# Altium project PCB.PrjPcb (part 2 of 2)
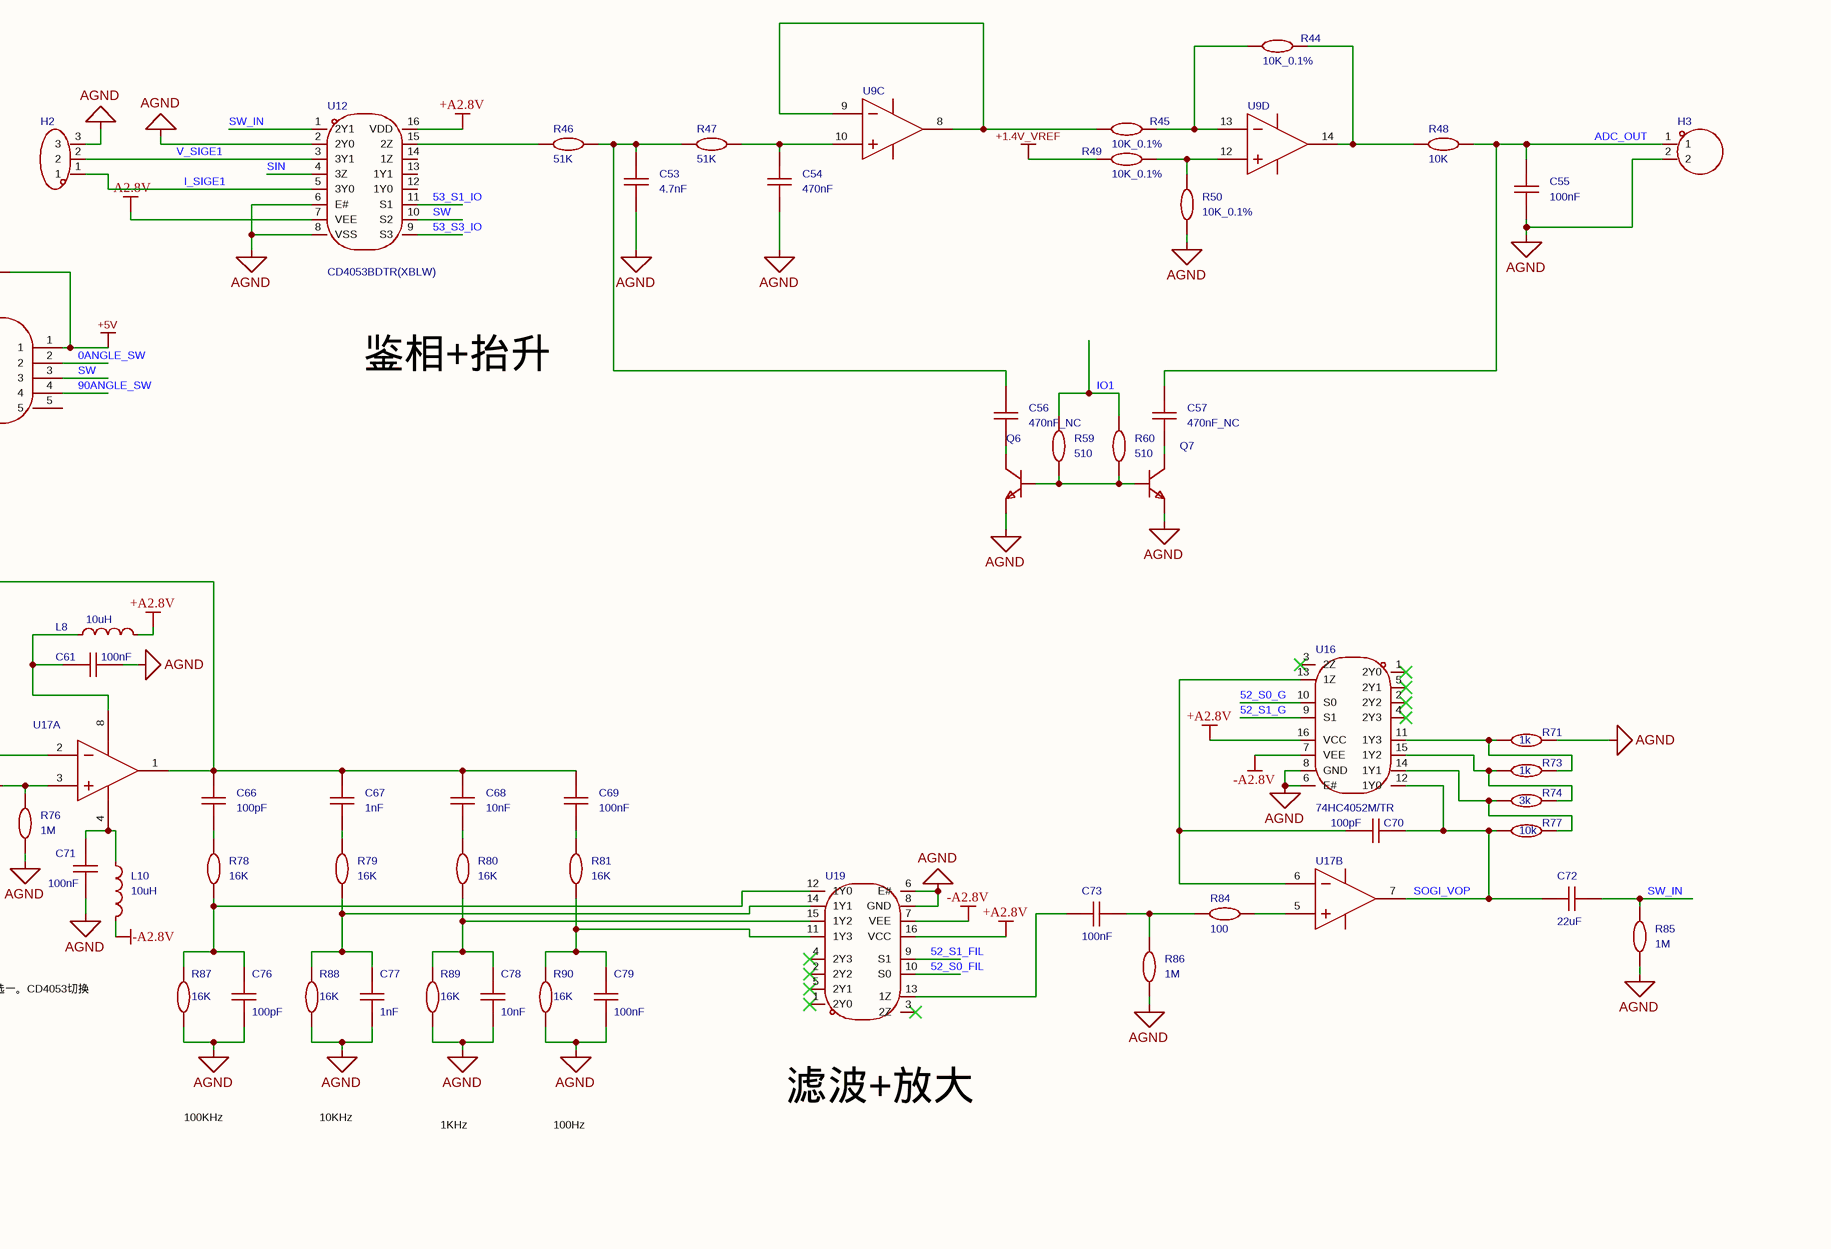
[diagram p8: Sheet1.SchDoc, row 4 of 4 right]

## Sheet Sheet1.SchDoc
size 800 x 1399 mm

### Parts
BAT1  XH2.54直插座-2P  [CONN-TH_XH2.54-2P]  (value not drawn)
BUZZER1  value 2.4kHz  [BUZ-TH_BD12.0-P7.60-D0.6-FD]  (hidden comment: TMB12A05_C96093)
C1  10uF  [C0805]
C2  100nF  [C0603]
C3  10uF  [C0805]
C4  value 22pF_NC  [C0603]  (hidden comment: CAP_0603)
C5  value 10nF  [C0603]  (hidden comment: CAP_0603)
C6  value 22pF  [C0603]  (hidden comment: CAP_0603)
C7  value 100nF  [C0603]  (hidden comment: CAP_0603)
C8  value 100nF  [C0603]  (hidden comment: CAP_0603)
C9  value 22uF  [C0805]  (hidden comment: CAP_0805)
C10  value 100nF  [C0603]  (hidden comment: CAP_0603)
C11  value 100nF  [C0603]  (hidden comment: CAP_0603)
C12  value 100nF  [C0603]  (hidden comment: CAP_0603)
C13  value 22pF  [C0603]  (hidden comment: CAP_0603)
C14  value 100nF  [C0603]  (hidden comment: CAP_0603)
C15  value 22pF  [C0603]  (hidden comment: CAP_0603)
C16  value 100nF  [C0603]  (hidden comment: CAP_0603)
C17  value 100nF  [C0603]  (hidden comment: CAP_0603)
C18  value 1uF  [C0603]  (hidden comment: CAP_0603)
C19  value 10nF  [C0603]  (hidden comment: CAP_0603)
C20  value 22uF  [C0805]  (hidden comment: CAP_0805)
C21  value 100nF  [C0603]  (hidden comment: CAP_0805)
C22  value 100nF  [C0603]  (hidden comment: CAP_0805)
C23  value 100nF  [C0603]  (hidden comment: CAP_0805)
C24  value 220uF  [CAP-TH_BD8.0-P3.50-D0.6-FD-2]  (hidden comment: KNH2220UF35V149EC0049)
C25  value 100nF  [C0603]  (hidden comment: CAP_0603)
C26  value 22uF  [C0805]  (hidden comment: CAP_0805)
C27  104  [C0603]
C28  104  [C0603]
C29  104  [C0603]
C30  104  [C0603]
C31  104  [C0603]
C32  104  [C0603]
C33  104  [C0603]
C34  104  [C0603]
C35  104  [C0603]
C36  104  [C0603]
C37  104  [C0603]
C38  104  [C0603]
C39  104  [C0603]
C40  value 100nF  [C0603]  (hidden comment: CAP_0603)
C41  value 100nF  [C0603]  (hidden comment: CAP_0603)
C42  value 22uF  [C0805]  (hidden comment: CAP_0805)
C43  value 22uF  [C0805]  (hidden comment: CAP_0805)
C44  value 100nF  [C0603]  (hidden comment: CAP_0603)
C45  value 22uF  [C0805]  (hidden comment: CAP_0805)
C46  value 100nF  [C0603]  (hidden comment: CAP_0603)
C47  value 100nF  [C0603]  (hidden comment: CAP_0603)
C48  value 100nF  [C0603]  (hidden comment: CAP_0603)
C49  value 100nF  [C0603]  (hidden comment: CAP_0402)
C50  value 100pF_NC  [C0603]  (hidden comment: CAP_0402)
C51  value 1uF  [C0603]  (hidden comment: CAP_0402)
C52  value 100nF  [C0603]  (hidden comment: CAP_0402)
C53  value 4.7nF  [C0603]  (hidden comment: CAP_0603)
C54  value 470nF  [C0603]  (hidden comment: CAP_0603)
C55  value 100nF  [C0603]  (hidden comment: CAP_0603)
C56  value 470nF_NC  [C0603]  (hidden comment: CAP_0603)
C57  value 470nF_NC  [C0603]  (hidden comment: CAP_0603)
C58  value 100pF_NC  [C0603]  (hidden comment: CAP_0402)
C59  value 220nF  [C0603]  (hidden comment: CAP_0402)
C60  value 220nF  [C0603]  (hidden comment: CAP_0402)
C61  value 100nF  [C0603]  (hidden comment: CAP_0603)
C62  value 220nF  [C0603]  (hidden comment: CAP_0402)
C63  value 100nF  [C0603]  (hidden comment: CAP_0402)
C64  value 100pF_NC  [C0603]  (hidden comment: CAP_0402)
C65  value 100nF  [C0603]  (hidden comment: CAP_0603)
C66  value 100pF  [C0603]  (hidden comment: CAP_0603)
C67  value 1nF  [C0603]  (hidden comment: CAP_0603)
C68  value 10nF  [C0603]  (hidden comment: CAP_0603)
C69  value 100nF  [C0603]  (hidden comment: CAP_0603)
C70  value 100pF  [C0603]  (hidden comment: CAP_0603)
C71  value 100nF  [C0603]  (hidden comment: CAP_0603)
C72  value 22uF  [C0805]  (hidden comment: CAP_0603)
C73  value 100nF  [C0603]  (hidden comment: CAP_0603)
C74  value 100nF  [C0603]  (hidden comment: CAP_0402)
C75  value 100pF  [C0603]  (hidden comment: CAP_0402)
C76  value 100pF  [C0603]  (hidden comment: CAP_0603)
C77  value 1nF  [C0603]  (hidden comment: CAP_0603)
C78  value 10nF  [C0603]  (hidden comment: CAP_0603)
C79  value 100nF  [C0603]  (hidden comment: CAP_0603)
C80  value 100pF_NC  [C0603]  (hidden comment: CAP_0402)
C81  value 220nF  [C0603]  (hidden comment: CAP_0402)
C82  value 220nF  [C0603]  (hidden comment: CAP_0402)
C83  value 220nF  [C0603]  (hidden comment: CAP_0402)
C84  value 100pF_NC  [C0603]  (hidden comment: CAP_0402)
CE1  3.3uF/16V  [C0805]
CE2  22uF/16V  [C0805]
CE3  22uF/16V  [C0805]
CE4  22uF/16V  [C0805]
CE5  22uF/16V  [C0805]
D1  Manufacturer Part: SS24  [SMA_L4.3-W2.6-LS5.0-FD]  (hidden comment: SS24_C7420362)
D2  Manufacturer Part: SS24  [SMA_L4.3-W2.6-LS5.0-FD]  (hidden comment: SS24_C7420362)
D3  FR107_C963379  [SOD-123_L2.8-W1.8-LS3.7-RD]  (value not drawn)
D4  BAT54S,215  [SOT-23-3_L3.0-W1.7-P0.95-LS2.9-BR]  (value not drawn)
D5  BAT54S,215  [SOT-23-3_L3.0-W1.7-P0.95-LS2.9-BR]  (value not drawn)
H1  (no value)  [HDR-TH_4P-P2.54-V-F]
H2  (no value)  [HDR-TH_3P-P2.54-V-M]
H3  HDR-M_2.54_1x2P  [HDR-TH_2P-P2.54-V-M-1]  (value not drawn)
H4  (no value)  [HDR-TH_5P-P2.54-V-M]
L1  value 10uH  [L0603]  (hidden comment: L_0603)
L2  BLM15AG102SN1D  [L0603]  (value not drawn)
L3  value 10uH  [IND-SMD_L7.3-W6.8]  (hidden comment: FXL0630-100-M)
L4  value 10uH  [L0603]  (hidden comment: L_0603)
L5  value 10uH  [L0603]  (hidden comment: L_0603)
L6  BLM15AG102SN1D  [L0603]  (value not drawn)
L7  BLM15AG102SN1D  [L0603]  (value not drawn)
L8  value 10uH  [L0603]  (hidden comment: L_0603)
L9  BLM15AG102SN1D  [L0603]  (value not drawn)
L10  value 10uH  [L0603]  (hidden comment: L_0603)
L11  BLM15AG102SN1D  [L0603]  (value not drawn)
LED1  LED_0603-R  [LED_0603]  (value not drawn)
LED2  LED_0603-R  [LED_0603]  (value not drawn)
LED3  LED_0603-R  [LED_0603]  (value not drawn)
LED4  LED_0603-R  [LED_0603]  (value not drawn)
LED5  LED_0603-R  [LED_0603]  (value not drawn)
LED6  LED_0603-R  [LED_0603]  (value not drawn)
P1  XH2.54直插座-2P  [CONN-TH_XH2.54-2P]  (value not drawn)
Q1  AO3401A_P  [AO3401A_SOT-23-3]
Q2  S8050_SOT_NPN  [S8050_SOT-23]  (value not drawn)
Q3  AO3401A_P  [AO3401A_SOT-23-3]
Q4  (no value)  [SOT-23-3_L2.9-W1.3-P1.90-LS2.4-BR]
Q5  AO3400A_C20917  [SOT-23-3_L2.9-W1.3-P1.90-LS2.4-BR]  (value not drawn)
Q6  S8050_SOT_NPN  [S8050_SOT-23]  (value not drawn)
Q7  S8050_SOT_NPN  [S8050_SOT-23]  (value not drawn)
R1  value 10K  [R0603]  (hidden comment: Res_0603)
R2  value 10K  [R0603]  (hidden comment: Res_0603)
R3  value 10K  [R0603]  (hidden comment: Res_0603)
R4  value 10K  [R0603]  (hidden comment: Res_0603)
R5  value 10K_NC  [R0603]  (hidden comment: Res_0603)
R6  value 10K_NC  [R0603]  (hidden comment: Res_0603)
R7  value 10K_NC  [R0603]  (hidden comment: Res_0603)
R8  value 10K  [R0603]  (hidden comment: Res_0603)
R9  value 1k  [R0603]  (hidden comment: Res_0603)
R10  value 1k  [R0603]  (hidden comment: Res_0603)
R11  value 10K  [R0603]  (hidden comment: Res_0603)
R12  value 10K  [R0603]  (hidden comment: Res_0603)
R13  value 510  [R0603]  (hidden comment: Res_0603)
R14  value 100  [R0603]  (hidden comment: Res_0805)
R15  value 100  [R0603]  (hidden comment: Res_0805)
R16  value 2k  [R0603]  (hidden comment: Res_0603)
R17  value 510  [R0603]  (hidden comment: Res_0603)
R18  value 10K  [R0603]  (hidden comment: Res_0805)
R19  value 2k  [R0603]  (hidden comment: Res_0603)
R20  value 10K  [R0603]  (hidden comment: Res_0603)
R21  value 10K  [R0603]  (hidden comment: Res_0603)
R22  value 2k  [R0603]  (hidden comment: Res_0603)
R23  value 10K  [R0603]  (hidden comment: Res_0805)
R24  value 2k  [R0603]  (hidden comment: Res_0603)
R25  value 5.1K  [R0603]  (hidden comment: Res_0603)
R26  value 5.1K  [R0603]  (hidden comment: Res_0603)
R27  value 1k  [R0603]  (hidden comment: Res_0603)
R28  value 10K  [R0603]  (hidden comment: Res_0603)
R29  value 10K  [R0603]  (hidden comment: Res_0603)
R30  value 11k  [R0603]  (hidden comment: Res_0603)
R31  value 10K  [R0603]  (hidden comment: Res_0603)
R32  value 10K  [R0603]  (hidden comment: Res_0603)
R33  value 10k  [R0603]  (hidden comment: Res_0603)
R34  value 1.5k  [R0603]  (hidden comment: Res_0603)
R35  value 10k_0.1%  [R0603]  (hidden comment: Res_0603)
R36  value 000  [R0603]  (hidden comment: Res_0603)
R37  value 000  [R0603]  (hidden comment: Res_0603)
R38  value 000  [R0603]  (hidden comment: Res_0603)
R39  value 10k  [R0603]  (hidden comment: Res_0603)
R40  value 10k_0.1%  [R0603]  (hidden comment: Res_0603)
R41  value 1M  [R0603]  (hidden comment: Res_0603)
R42  value 100  [R0603]  (hidden comment: Res_0603)
R43  value 5.1K  [R0603]  (hidden comment: Res_0603)
R44  value 10K_0.1%  [R0603]  (hidden comment: Res_0603)
R45  value 10K_0.1%  [R0603]  (hidden comment: Res_0603)
R46  value 51K  [R0603]  (hidden comment: Res_0603)
R47  value 51K  [R0603]  (hidden comment: Res_0603)
R48  value 10K  [R0603]  (hidden comment: Res_0603)
R49  value 10K_0.1%  [R0603]  (hidden comment: Res_0603)
R50  value 10K_0.1%  [R0603]  (hidden comment: Res_0603)
R51  value 1k  [R0603]  (hidden comment: Res_0603)
R52  value 100k  [R0603]  (hidden comment: Res_0603)
R53  value 10k  [R0603]  (hidden comment: Res_0603)
R54  value 1k  [R0603]  (hidden comment: Res_0603)
R55  value 20  [R0603]  (hidden comment: Res_0603)
R56  value 10K  [R0603]  (hidden comment: Res_0603)
R57  value 10K  [R0603]  (hidden comment: Res_0603)
R58  value 20  [R0603]  (hidden comment: Res_0603)
R59  value 510  [R0603]  (hidden comment: Res_0603)
R60  value 510  [R0603]  (hidden comment: Res_0603)
R61  value 1M  [R0603]  (hidden comment: Res_0603)
R62  value 1k  [R0603]  (hidden comment: Res_0603)
R63  value 3k  [R0603]  (hidden comment: Res_0603)
R64  value 100  [R0603]  (hidden comment: Res_0603)
R65  value 1k_0.1%  [R0603]  (hidden comment: Res_0603)
R66  value 1M  [R0603]  (hidden comment: Res_0603)
R67  value 100  [R0603]  (hidden comment: Res_0603)
R68  value 1k_0.1%  [R0603]  (hidden comment: Res_0603)
R69  value 100  [R0603]  (hidden comment: Res_0603)
R70  value 3k  [R0603]  (hidden comment: Res_0603)
R71  value 1k  [R0603]  (hidden comment: Res_0603)
R72  value 1k  [R0603]  (hidden comment: Res_0603)
R73  value 1k  [R0603]  (hidden comment: Res_0603)
R74  value 3k  [R0603]  (hidden comment: Res_0603)
R75  value 000  [R0603]  (hidden comment: Res_0603)
R76  value 1M  [R0603]  (hidden comment: Res_0603)
R77  value 10k  [R0603]  (hidden comment: Res_0603)
R78  value 16K  [R0603]  (hidden comment: Res_0603)
R79  value 16K  [R0603]  (hidden comment: Res_0603)
R80  value 16K  [R0603]  (hidden comment: Res_0603)
R81  value 16K  [R0603]  (hidden comment: Res_0603)
R82  value 100  [R0603]  (hidden comment: Res_0603)
R83  value 1M  [R0603]  (hidden comment: Res_0603)
R84  value 100  [R0603]  (hidden comment: Res_0603)
R85  value 1M  [R0603]  (hidden comment: Res_0603)
R86  value 1M  [R0603]  (hidden comment: Res_0603)
R87  value 16K  [R0603]  (hidden comment: Res_0603)
R88  value 16K  [R0603]  (hidden comment: Res_0603)
R89  value 16K  [R0603]  (hidden comment: Res_0603)
R90  value 16K  [R0603]  (hidden comment: Res_0603)
R91  value 3k  [R0603]  (hidden comment: Res_0603)
R92  value 20_0.1%  [R0603]  (hidden comment: Res_0603)
R93  value 100  [R0603]  (hidden comment: Res_0603)
R94  value 1k_0.1%  [R0603]  (hidden comment: Res_0603)
R95  value 10k_0.1%  [R0603]  (hidden comment: Res_0603)
R96  value 1k_0.1%  [R0603]  (hidden comment: Res_0603)
R97  value 1M  [R0603]  (hidden comment: Res_0603)
R98  value 100k_0.1%  [R0603]  (hidden comment: Res_0603)
R99  value 100  [R0603]  (hidden comment: Res_0603)
R100  value 1k_0.1%  [R0603]  (hidden comment: Res_0603)
R101  value 3k  [R0603]  (hidden comment: Res_0603)
R102  value 100  [R0603]  (hidden comment: Res_0603)
SCREW1  (no value)  [M3螺丝]
SCREW2  (no value)  [M3螺丝]
SCREW3  (no value)  [M3螺丝]
SCREW4  (no value)  [M3螺丝]
SW1  (no value)  [Key_SMD_3.6x6.1x2.5]
SW2  (no value)  [SW-TH_4P-L6.0-W6.0-P4.50-LS6.5]
SW3  (no value)  [SW-TH_4P-L6.0-W6.0-P4.50-LS6.5]
SW4  (no value)  [SW-TH_4P-L6.0-W6.0-P4.50-LS6.5]
SW5  (no value)  [SW-TH_4P-L6.0-W6.0-P4.50-LS6.5]
SW6  XKB7070-Z  [SW-TH_6P-L7.0-W7.0-P2.00]  (value not drawn)
U1  RS8752XM  [MSOP-8_L3.0-W3.0-P0.65-LS5.0-BL]  (value not drawn)  (parts A,B of 2)
U2  74HC4052M/TR  [SOP-16_L9.9-W3.9-P1.27-LS6.0-BL]  (value not drawn)
U3  AD9833BRMZ-REEL7_C9652  [MSOP-10_L3.0-W3.0-P0.50-LS5.0-BL]  (value not drawn)
U4  STC32G12K128-35I-LQFP48  [LQFP-48_L7.0-W7.0-P0.50-LS9.0-BL]
U5  CH340N  [SOP-8_L4.9-W3.9-P1.27-LS6.0-BL]
U6  TP4056-42-ESOP8  [ESOP-8_L4.9-W3.9-P1.27-LS6.0-BL-EP]  (value not drawn)
U7  RT9193-28G  [SOT-23-5_L3.0-W1.7-P0.95-LS2.8-BR]
U8  SGM3204  [SOT-23-6_L2.9-W1.6-P0.95-LS2.8-BL]
U9  RS8554XQ  [TSSOP-14_L5.0-W4.4-P0.65-LS6.4-BL]  (value not drawn)  (parts A,B,C,D of 4)
U10  SX1308  [SOT-23-6_L2.9-W1.6-P0.95-LS2.8-BL]
U11  RS8554XP  [TSSOP-14_L5.0-W4.4-P0.65-LS6.4-BL]  (value not drawn)  (parts A,B,C,D of 4)
U12  CD4053BDTR(XBLW)  [SOP-16_L9.9-W3.9-P1.27-LS6.0-BL]
U13  GAQY211G2S  [SOP-4_L4.4-W4.0-P2.54-LS7.0-TL]
U14  74HC4052M/TR  [SOP-16_L9.9-W3.9-P1.27-LS6.0-BL]  (value not drawn)
U15  hfd31/5  [RELAY-SMD_HFD31-XX-L2SR]
U16  74HC4052M/TR  [SOP-16_L9.9-W3.9-P1.27-LS6.0-BL]
U17  RS8752XM  [MSOP-8_L3.0-W3.0-P0.65-LS5.0-BL]  (value not drawn)  (parts A,B of 2)
U18  RS8554XP  [TSSOP-14_L5.0-W4.4-P0.65-LS6.4-BL]  (value not drawn)  (parts A,B,C,D of 4)
U19  74HC4052M/TR  [SOP-16_L9.9-W3.9-P1.27-LS6.0-BL]  (value not drawn)
U20  74HC4052M/TR  [SOP-16_L9.9-W3.9-P1.27-LS6.0-BL]
USBC1  TYPE-C-31-M-12  [USB-C_SMD-TYPE-C-31-M-12]  (value not drawn)
X1  value 25MHz  [OSC-SMD_4P-L3.2-W2.5-BL]  (hidden comment: OT322525MJBA4SL)
X2  value 24MHz  [CRYSTAL-SMD_L11.5-W4.8-LS12.7]  (hidden comment: X49SM8MSD2SC)

### Blocks framed on the sheet
主控-信号采集及处理电路: BUZZER1 C13-C23 H1 L2 LED1-LED4 Q1-Q3 R12-R23 SW1-SW5 U4 U5 X2
供电电路: BAT1 C24-C26 C40 C42-C46 D1 D2 L3 LED5 LED6 Q4 R24-R28 R30 R32-R34 R37-R39 SCREW1-SCREW4 SW6 U6 U10 USBC1
DDS信号发生器电路: C1-C12 L1 R1-R11 U1-U3 X1
信号采样电路: C27-C39 C41 C47-C84 CE1-CE5 D3-D5 H2-H4 L4-L11 P1 Q5-Q7 R29 R31 R35 R36 R40-R102 U7-U9 U11-U20

### Nets
+1.4V_VREF: R36.2 R49.2
+2.8V_VREF: C17.1 C18.1 C19.1 L2.2 U4.16(Vref)
+5V: C22.2 D3.1(C) Q1.2(S) Q3.2(S) R18.2 SW6.1 U5.5(VCC) U15.1
+5V_MCU: BUZZER1.1(+) C8.2 C12.2 C35.2 CE5.1 H1.2 L1.1 P1.2 Q1.3(D) R11.2 R12.1 R20.1 R21.1 R22.1 U4.15(VCC/AVCC) U7.1(VIN) U7.3(EN) X1.4(VDD)  [also labelled VIN]
+A2.8V: C20.1 C27.2 C28.2 C29.2 C30.2 C36.2 C39.2 CE2.1 CE3.1 D4.2(K) D5.2(K) L2.1 L4.2 L7.2 L8.2 L11.1 R29.1 U7.5(VOUT) U8.2(IN) U8.5(EN) U12.16(VDD) U14.16(VCC) U16.16(VCC) U19.16(VCC) U20.16(VCC)
-A2.8V: C31.2 C32.2 C33.2 C34.2 C37.2 CE4.1 D4.1(A) D5.1(A) L5.2 L6.1 L9.1 L10.2 U8.1(OUT) U12.7(VEE) U14.7(VEE) U16.7(VEE) U19.7(VEE) U20.7(VEE)
AGND: C1.1 C2.2 C4.1 C6.1 C7.1 C9.1 C10.1 C27.1 C28.1 C29.1 C30.1 C31.1 C32.1 C33.1 C34.1 C35.1 C36.1 C37.1 C38.1 C39.1 C41.2 C47.2 C48.2 C49.2 C50.2 C52.1 C53.2 C54.2 C55.2 C61.2 C63.2 C64.2 C71.2 C74.2 C76.1 C77.1 C78.1 C79.1 C80.2 CE2.2 CE3.2 CE4.2 CE5.2 H2.3 H3.2 H4.1 P1.1 Q6.2 Q7.2 R9.2 R31.2 R37.2 R40.1 R41.2 R50.2 R61.2 R66.2 R70.1 R71.2 R75.2 R76.1 R83.2 R85.2 R86.1 R87.1 R88.1 R89.1 R90.1 R91.1 R97.2 U1.4(V-) U2.6(E#) U2.7(VEE) U2.8(GND) U3.9(AGND) U7.2(GND) U8.4(GND) U12.2(2Y0) U12.6(E#) U12.8(VSS) U13.2 U14.6(E#) U14.8(GND) U16.6(E#) U16.8(GND) U19.6(E#) U19.8(GND) U20.6(E#) U20.8(GND)
DDS_5V: C2.1 C5.1 C7.2 C9.2 C10.2 L1.2 R10.1 U1.8(V+) U2.16(VCC) U3.2(VDD)
GND: C8.1 C11.1 C12.1 C13.1 C14.1 C15.2 C16.2 C17.2 C18.2 C19.2 C20.2 C21.1 C22.1 H1.1 LED1.1(C) LED2.1(C) LED3.1(C) LED4.1(C) Q2.2 Q5.2(S) R23.1 R37.1 R38.2 R57.1 SW1.2 SW2.3 SW2.4 SW3.3 SW3.4 SW4.3 SW4.4 SW5.3 SW5.4 U3.4(DGND) U4.17(GND/AGND/Vref-) U5.3(GND) X1.2(GND)
PGND: BAT1.2 C24.2 C25.1 C26.1 C40.1 C42.1 C43.1 C44.1 C45.1 C46.1 Q4.2(S) R25.1 R26.2 R27.1 R32.1 R34.1 R38.1 R39.2 U6.1(TEMP) U6.3(GND) U6.9(EP) U10.2(GND) USBC1.0(SH) USBC1.1(SH) USBC1.2(SH) USBC1.3(SH) USBC1.A1(GND) USBC1.A12(GND) USBC1.B1(GND) USBC1.B12(GND)
VBAT: BAT1.1 C26.2 C45.2 C46.2 L3.2 R28.2 R33.1 U6.5(BAT) U10.5(VIN)
VBAT_OUT: C42.2 C43.2 C44.2 D1.2(K) D2.2(K) R30.2 SW6.2
VIN_5V: C24.1 C25.2 D2.1(A) Q4.1(G) R24.2 R39.1 U6.4(VCC) U6.8(CE) USBC1.A4(VBUS) USBC1.A9(VBUS) USBC1.B4(VBUS) USBC1.B9(VBUS)
0ANGLE_SW: U4.33(PWM5/PWM1P_2/A8/P2.0) U15.2  [also labelled P20]
52_S0_DDS: U2.10(S0) U4.39(PWM4P_2/A14/P2.6)  [also labelled P26]
52_S0_FIL: U4.41(CAN_TX_3/ALE/P4.5) U19.10(S0)  [also labelled P45]
52_S0_G: U4.25(CAN_TX_2/CMP+_3/TXD3_2/P5.1) U16.10(S0)  [also labelled P51]
52_S1_DDS: U2.9(S1) U4.40(PWM4N_2/A15/P2.7)  [also labelled P27]
52_S1_FIL: U4.42(CAN_RX_3/CAN2_RX_3/RXD2_2/P4.6) U19.9(S1)  [also labelled P46]
52_S1_G: U4.24(P5.0/RXD3_2/CMP+_2/CAN_RX_2) U16.9(S1)  [also labelled P50]
53_S1_IO: U4.37(PWM3P_2/SDA_2/S2MISO_2/S1MISO_2/MISO_2/A12/P2.4) U12.11(S1)  [also labelled P24]
53_S3_IO: U4.32(TXD_4/RD/P4.4) U12.9(S3)  [also labelled P44]
90ANGLE_SW: U4.35(PWM7/PWM2P_2/S2SS_2/S1SS_2/SS_2/A10/P2.2) U15.4  [also labelled P22]
ADC_OUT: C55.1 C57.1 H3.1 R48.2 U4.46(LINTX/CAN2_TX/PWM8_3/TXD4/ADC11/AD3/P0.3)  [also labelled P03]
ADC_VBAT: C40.2 R28.1 R32.2 U4.47(T3/ADC12/AD4/P0.4)  [also labelled P04]
BUZZER: R17.1 U4.22(P3.3/INT1/MISO_4/SDA_4/PWM4N_4/PWM7_2)  [also labelled P33]
CHRG: LED5.1(C) U4.30(CAN_RX_3/WR/P4.2) U6.7(CHRG#)  [also labelled P42]
D+: U5.1(UD+) USBC1.A6(DP1) USBC1.B6(DP2)
D-: U5.2(UD-) USBC1.A7(DN1) USBC1.B7(DN2)
DDS_SIGN: C3.1 C6.2 U3.10(VOUT)
DDS_VOUT: R43.2 U1.6(-INB) U1.7(OUTB)
FSYNC: U3.8(FSYNC) U4.26(PWMFLT/SS_4/T0CLKO/T1/P3.5)  [also labelled P35]
I_SIGE1: H2.1 R99.1 U12.5(3Y0)
IO1: R59.2 R60.1 U4.27(CMP-/RXD_2/INT2/P3.6)  [also labelled P36]
IO2: R51.1 U4.9(P1.5/ADC5/PWM3N/SCLK/S1CLK/S2CLK/SCL)  [also labelled P15]
IR_S0: U4.7(P4.7/TXD2_2/CAN2_TX_3/LIN_TX_3) U20.10(S0)  [also labelled P47]
IR_S1: U4.8(P1.4/ADC4/PWM3P/MISO/S1MISO/S2MISO/SDA) U20.9(S1)  [also labelled P14]
KEY1: SW2.1 U4.4(P0.7/AD7/T4CLKO)  [also labelled P07]
KEY2: SW3.1 U4.3(P0.6/AD6/ADC14/T4/PWMFLT2_2)  [also labelled P06]
KEY3: SW4.1 U3.5(MCLK) U4.2(P0.5/AD5/ADC13/T3CLKO) X1.3(OUT)  [also labelled P05]
KEY4: SW5.1 U4.1(P5.3/TXD4_2/CAN2_TX_2/LIN_TX_2)  [also labelled P53]
LED1: R13.1 R56.2 U4.45(LIN_RX/CAN2_RX/PWM7_3/RXD4/ADC10/AD2/P0.2)  [also labelled P02]
LED2: R16.1 U4.44(CAN_TX/PWM6_3/TXD3/ADC9/AD1/P0.1)  [also labelled P01]
LED3: R19.1 U4.43(CAN_RX/PWM5_3/RXD3/ADC8/AD0/P0.0)  [also labelled P00]
NRST: C14.2 R12.2 SW1.1 U4.14(P5.4/ADC2/PWM2P/PWM6_2/RST/MCLKO/SS_3/S1SS_3/S2SS_3/T2)
P10: U4.5(P1.0/ADC0/PWM1P/RXD2) U14.9(S1)  [also labelled VR_S1]
P11: U4.6(P1.1/ADC1/PWM1N/TXD2) U14.10(S0)  [also labelled VR_S0]
P13: U4.12(P1.3/ADC3/MOSI/S2MOSI/S1MOSI/PWM2N/T2CLKO)
P16: C13.2 U4.10(P1.6/ADC6/RXD_3/PWM4P/MCLKO_2/XTALO) X2.1(OSC1)  [also labelled XTALO]
P17: C15.1 U4.11(P1.7/ADC7/TXD_3/PWM4N/PWM5_2/XTALI) X2.2(OSC2)  [also labelled XTALI]
P21: U4.34(PWM6/PWM1N_2/A9/P2.1)
P23: H1.4 R20.2 U4.36(PWM8/PWM2N_2/S2MOSI_2/S1MOSI_2/MOSI_2/A11/P2.3)  [also labelled SDA]
P25: H1.3 R21.2 U4.38(PWM3N_2/SCL_2/S2SCLK_2/S1SCLK_2/SCLK_2/A13/P2.5)  [also labelled SCL]
P30: R15.2 U4.19(P3.0/D-/RXD/INT4)  [also labelled RXD]
P31: R14.2 U4.20(P3.1/D+/TXD)  [also labelled TXD]
P32: U3.7(SCLK) U4.21(P3.2/INT0/SCLK_4/SCL_4/PWMETI/PWMETI2)  [also labelled SCLK]
P34: U3.6(SDATA) U4.23(P3.4/T0/T1CLKO/MOSI_4/PWM4P_4/PWM8_2/CMPO)  [also labelled SDATA]
P37: U4.28(CMP+/TXD_2/INT3/P3.7) U9.1(OUTA)  [also labelled SOGI_VOP_COMP]
P40: U4.18(P4.0/MOSI_3/S1MOSI_3/S2MOSI_3)
P41: LED6.1(C) U4.29(PWMETI_3/CMPO_2/S2MISO_3/S1MISO_3/MISO_3/P4.1) U6.6(STDBY#)  [also labelled STDBY]
P43: U4.31(S2SCLK_3/S1SCLK_3/SCLK/RXD_4/P4.3)
P52: U4.48(LIN_RX_2/CAN2_RX_2/RXD4_2/P5.2)
SIN: C65.1 U12.4(3Z)
SOGI_VOP: C70.1 C72.2 R77.2 U9.2(-INA) U16.12(1Y0) U17.7(OUTB)
SW: U12.10(S2) U15.3
SW_IN: C72.1 R85.1 U12.1(2Y1)
V_SIGE1: H2.2 R67.1 U12.3(3Y1)
NetBUZZER1_2: BUZZER1.2 Q2.3
NetC1_2: C1.2 R1.1
NetC3_2: C3.2 U2.3(2Z)
NetC4_2: C4.2 R3.2 U1.5(+INB)
NetC5_2: C5.2 U3.1(COMP)
NetC11_2: C11.2 U3.3(CAP/2.5V)
NetC16_1: C16.1 U4.13(UCAP)
NetC21_2: C21.2 U5.8(V3)
NetC23_1: C23.1 U5.4(RTS#)
NetC23_2: C23.2 Q3.1(G) R18.1
NetC38_2: C38.2 U7.4(BP)
NetC41_1: C41.1 L4.1 R35.2
NetC47_1: C47.1 R35.1 R40.2 U9.5(+INB)
NetC48_1: C48.1 L5.1
NetC49_1: C49.1 L6.2 U11.11(V-)
NetC50_1: C50.1 C51.2 R43.1
NetC51_1: C51.1 R41.1 R42.2
NetC52_2: C52.2 L7.1 U11.4(V+)
NetC53_1: C53.1 C56.1 R46.1 R47.2
NetC54_1: C54.1 R47.1 U9.10(+INC)
NetC56_2: C56.2 Q6.3
NetC57_2: C57.2 Q7.3
NetC58_1: C58.1 C60.1 R63.2 U11.8(OUTC)
NetC58_2: C58.2 R63.1 R65.2 U11.9(INC-)
NetC59_1: C59.1 H4.4 R62.1
NetC59_2: C59.2 R61.1 R64.1
NetC60_2: C60.2 R67.2
NetC61_1: C61.1 L8.1 U17.8(V+)
NetC62_1: C62.1 D5.3(AK) H4.3 R72.2
NetC62_2: C62.2 R66.1 R69.1
NetC63_1: C63.1 L9.2 U18.11(V-)
NetC64_1: C64.1 R68.2 R70.2 U11.10(INC+)
NetC65_2: C65.2 R76.2 U17.3(+INA)
NetC66_1: C66.1 R78.2
NetC66_2: C66.2 C67.2 C68.2 C69.2 U17.1(OUTA) U17.2(-INA)
NetC67_1: C67.1 R79.2
NetC68_1: C68.1 R80.2
NetC69_1: C69.1 R81.2
NetC70_2: C70.2 U16.13(1Z) U17.6(-INB)
NetC71_1: C71.1 L10.1 U17.4(V-)
NetC73_1: C73.1 R84.2 R86.2
NetC73_2: C73.2 U19.13(1Z)
NetC74_1: C74.1 L11.2 U18.4(V+)
NetC75_1: C75.1 C83.1 H4.2 R72.1 R82.1 R92.1 R94.1 R95.1 R98.1
NetC75_2: C75.2 U18.1(OUTA) U20.3(2Z)
NetC76_2: C76.2 R78.1 R87.2 U19.12(1Y0)
NetC77_2: C77.2 R79.1 R88.2 U19.14(1Y1)
NetC78_2: C78.2 R80.1 R89.2 U19.15(1Y2)
NetC79_2: C79.2 R81.1 R90.2 U19.11(1Y3)
NetC80_1: C80.1 R91.2 R96.2 U18.10(INC+)
NetC81_1: C81.1 U20.13(1Z)
NetC81_2: C81.2 R83.1 R93.1
NetC82_1: C82.1 C84.2 R101.1 U18.8(OUTC)
NetC82_2: C82.2 R99.2
NetC83_2: C83.2 R97.1 R102.1
NetC84_1: C84.1 R100.2 R101.2 U18.9(INC-)
NetCE1_1: CE1.1 U8.6(C+)
NetCE1_2: CE1.2 U8.3(C-)
NetD1_1: D1.1(A) L3.1 U10.1(SW)
NetD3_2: D3.2(A) Q5.3(D) U15.10
NetD4_3: D4.3(AK) H4.5 R58.1 R62.2
NetLED1_2: LED1.2(A) R13.2
NetLED2_2: LED2.2(A) R16.2
NetLED3_2: LED3.2(A) R19.2
NetLED4_2: LED4.2(A) R22.2
NetLED5_2: LED5.2(A) LED6.2(A) R24.1
NetQ1_1: Q1.1(G) Q3.3(D) R23.2
NetQ2_1: Q2.1 R17.2
NetQ4_3: Q4.3(D) R33.2 U10.4(EN)
NetQ5_1: Q5.1(G) R56.1 R57.2
NetQ6_1: Q6.1 Q7.1 R59.1 R60.2
NetR1_2: R1.2 R2.1 U1.2(-INA)
NetR2_2: R2.2 R3.1 U1.1(OUTA)
NetR4_1: R4.1 U2.1(2Y0)
NetR4_2: R4.2 R5.2 R6.2 R7.2 R8.2 U1.3(+INA)
NetR5_1: R5.1 U2.5(2Y1)
NetR6_1: R6.1 U2.2(2Y2)
NetR7_1: R7.1 U2.4(2Y3)
NetR8_1: R8.1 R9.1 R10.2
NetR11_1: R11.1 X1.1(Enable/Disable)
NetR14_1: R14.1 U5.7(RXD)
NetR15_1: R15.1 U5.6(TXD)
NetR25_2: R25.2 USBC1.B5(CC2)
NetR26_1: R26.1 USBC1.A5(CC1)
NetR27_2: R27.2 U6.2(PROG)
NetR29_2: R29.2 R31.1 U9.3(+INA)
NetR30_1: R30.1 R34.2 U10.3(FB)
NetR36_1: R36.1 U9.6(-INB) U9.7(OUTB)
NetR42_1: R42.1 U11.3(INA+)
NetR44_1: R44.1 R48.1 U9.14(OUTD)
NetR44_2: R44.2 R45.1 U9.13(-IND)
NetR45_2: R45.2 U9.8(OUTC) U9.9(-INC)
NetR46_2: R46.2 U12.15(2Z)
NetR49_1: R49.1 R50.1 U9.12(+IND)
NetR51_2: R51.2 U13.1
NetR52_1: R52.1 R53.1 R54.1 R55.1 R58.2
NetR52_2: R52.2 U14.1(2Y0)
NetR53_2: R53.2 U14.5(2Y1)
NetR54_2: R54.2 U14.2(2Y2)
NetR55_2: R55.2 U13.4 U14.4(2Y3)
NetR64_2: R64.2 U11.5(INB+)
NetR65_1: R65.1 U11.6(INB-) U11.7(OUTB)
NetR68_1: R68.1 U11.13(IND-) U11.14(OUTD)
NetR69_2: R69.2 U11.12(IND+)
NetR71_1: R71.1 R73.2 U16.11(1Y3)
NetR73_1: R73.1 R74.1 U16.15(1Y2)
NetR74_2: R74.2 R77.1 U16.14(1Y1)
NetR75_1: R75.1 U18.3(INA+)
NetR82_2: R82.2 U18.2(INA-)
NetR84_1: R84.1 U17.5(+INB)
NetR92_2: R92.2 U20.1(2Y0) U20.12(1Y0)
NetR93_2: R93.2 U18.5(INB+)
NetR94_2: R94.2 U20.5(2Y1) U20.14(1Y1)
NetR95_2: R95.2 U20.2(2Y2) U20.15(1Y2)
NetR96_1: R96.1 U18.6(INB-) U18.7(OUTB)
NetR98_2: R98.2 U20.4(2Y3) U20.11(1Y3)
NetR100_1: R100.1 U18.13(IND-) U18.14(OUTD)
NetR102_2: R102.2 U18.12(IND+)
NetU11_1: U11.1(OUTA) U11.2(INA-) U13.3 U14.3(2Z)

Not connected (* = marked no-connect by the designer): SCREW1 1; SCREW2 1; SCREW3 1; SCREW4 1; SW2 2; SW3 2*; SW4 2*; SW5 2*; SW6 3* 4* 5* 6*; U2 11(1Y3)* 12(1Y0)* 13(1Z)* 14(1Y1)* 15(1Y2)*; U9 4(V+) 11(V-); U10 6(NC)*; U12 12(1Y0) 13(1Y1) 14(1Z); U14 11(1Y3)* 12(1Y0)* 13(1Z)* 14(1Y1)* 15(1Y2)*; U15 5 6 7 8 9; U16 1(2Y0)* 2(2Y2)* 3(2Z)* 4(2Y3)* 5(2Y1)*; U19 1(2Y0)* 2(2Y2)* 3(2Z)* 4(2Y3)* 5(2Y1)*; USBC1 A8(SBU1)* B8(SBU2)*

### Notes on the sheet
- 复位电路
- 晶振电路
- 采样电路      提供ADC没模块
- OLED显示
- 程序烧录模块CH340N
- USB供电电路
- 单节 3.7V 锂离子 / 锂聚合物电池的完整线性充电管理电路
- 总开关
- 模拟地（AGND）与功率地（PGND）的单点互连与抗干扰隔离。防止数字地（功率回路）的噪声耦合到模拟电路（ADC、运放、Vref 等）。
- 这是锂电池电压 VBAT 的分压采样电路，核心作用是：将 3.7V~4.2V 的电池电压按比例降压，适配 STC32 单片机的 ADC 输入范围，实现电池电量实时监测（比如在 OLED 上显示剩余电量、低电压报警）。
- 将电池电压 VBAT（约 3.7V~4.2V）升压到 VBAT_OUT（稳定的 5V），为后级系统提供纯净的 5V 电源。
- 滤波电路
- 降压电路
- 正负电压生成电路
- (near U9) 换挡检测
- 鉴相+抬升
- (near C59) C27 C34 C49 C51电容短路精度会变高
- 电流，电压二选一。CD4053切换
- 100KHz
- 10KHz
- (near U19) 滤波+放大
- 1KHz
- 100Hz
- 信号采集电路
- (in symbol 3.3uF/16V) +
- (in symbol 22uF/16V) +

### Library data of the parts
BAT1 P1 = XH2.54直插座-2P: AddInBom: yes; ModelId: dc9654a6caad4c20aab3bc231ea458cf; ModelTransform: 296.889,230.315,0,0,0,0,0,26.653,-137.795; Symbol: XH2.54直插座-2P; Device: XH2.54直插座-2P; LCSC Part Name: XH2.54直插座-2P; SupplierPart: C9900016957; ManufacturerPart: XH2.54直插座-2P; Supplier Footprint: XH2.54-2; JLCPCB Part Class: 扩展库; Supplier: LCSC; ConvertToPcb: yes; FootprintName: CONN-TH_XH2.54-2P; ModelName: CONN-TH_XH2.54-2P
BUZZER1 = TMB12A05_C96093: 驱动方式:有源(内含驱动线路);构造类型:电磁式;额定电压:-;频率:2.4kHz;声压(SPL):85dB;; Manufacturer: 华能; AddInBom: yes; ModelId: 16ab50e14c5b4f2c986c135bdba60e37; ModelName: BUZ-TH_D12.0-H9.5-P7.60; ModelTransform: 472.44,472.176,0,90,0,0,-0.787,0,-177.165; Voltage - Supply: 4V~8V; Sound Pressure Level(SPL): 85dB; Symbol: TMB12A05; Device: TMB12A05_C96093; LCSC Part Name: TMB12A05; SupplierPart: C96093; ManufacturerPart: TMB12A05; Supplier Footprint: 插件,D=12mm; JLCPCB Part Class: 扩展库; Datasheet: https://atta.szlcsc.com/upload/public/pdf/source/20241025/8A17FE04D767D19A35A06DEF9A82AB1E.pdf; Supplier: LCSC; ConvertToPcb: yes; FootprintName: BUZ-TH_BD12.0-P7.60-D0.6-FD; Driver Circuitry: 有源(内含驱动线路); Technology: 电磁式; Voltage Rating: -; Current Consumption: -; Diameter(φD): 12mm; Length: -; Width: -; Height: 9.8mm; Operating Temperature: -
C1-C8 C10-C19 C25 C40 C41 C44 C46-C48 C53-C57 C61 C65-C73 C76-C79 = CAP_0603: ConvertToPcb: yes; SymbolName: CapAcitance; ModelId: ac125912035d415993ca9572d50418b1; ModelName: C0603_L1.6-W0.8-H0.8; ModelTransform: 62.992,31.496,0,0,0,0,0,0,0; Device: CAP_0603; AddInBom: yes; Supplier Footprint: 0603
  C1 C3: Value: 10uF; FootprintName: C0805
  C2: FootprintName: C0603; Value: 100nF
  C4-C8 C10-C19 C25 C40 C41 C44 C46-C48 C53-C57 C61 C65-C71 C73 C76-C79: FootprintName: C0603
  C72: FootprintName: C0805
C9 C20-C23 C26 C42 C43 C45 = CAP_0805: ConvertToPcb: yes; SymbolName: CapAcitance; ModelId: 1ba041120af144c991958decab20d241; ModelName: C0805_L2.0-W1.3-H1.3; ModelTransform: 78.74,51.181,0,0,0,0,0,0.0005,0; Device: CAP_0805; AddInBom: yes; Supplier Footprint: 0805
  C9 C20 C26 C42 C43 C45: FootprintName: C0805
  C21-C23: FootprintName: C0603
C24 = KNH2220UF35V149EC0049: 容值:220uF;精度:±20%;额定电压:35V;纹波电流:1.7A@100kHz;等效串联电阻:40mΩ@100kHz;; Manufacturer: KNSCHA(科尼盛); AddInBom: yes; ModelId: fd7be3432f664311809e69e3b3557c13; ModelTransform: 314.96,315.3537,0,90,0,0,0,0,-196.85; Tolerance: ±20%; Rated Voltage: 35V; φD: 8mm; L: 9mm; Lifetime @ Temp: 2000hrs@105℃; Symbol: KNH2220UF35V149EC0049; Device: KNH2220UF35V149EC0049; LCSC Part Name: 220uF ±20% 35V; SupplierPart: C2981462; ManufacturerPart: KNH2220UF35V149EC0049; Supplier Footprint: 插件,D8xL9mm; JLCPCB Part Class: 扩展库; Datasheet: https://atta.szlcsc.com/upload/public/pdf/source/20220426/9FC8A158D93B909CC105160B4A0CB698.pdf; Supplier: LCSC; ConvertToPcb: yes; FootprintName: CAP-TH_BD8.0-P3.50-D0.6-FD-2; ModelName: CAP-TH_BD8.0-P3.50-D0.6-FD-2; Ripple Current: 1.7A@100kHz; Equivalent Series Resistance(ESR): 40mΩ@100kHz; Lead Spacing: 3.5mm; Operating Temperature: -55℃~+105℃
C27-C39 = 104: 贴片电容/MLCC电容; Origin Footprint: C0603_M; Symbol: C; BOM名称: 无极性贴片电容; 联系卖家，免费查找封装: 唯一出售店铺网址https://shop463601444.taobao.com; AddInBom: yes; Device: 104; Design Item ID: C; Library Name: 0.1 - 电阻-电容-电感-晶振-晶体-磁珠-电位器-法拉电容-馈通电容; ConvertToPcb: yes
C49-C52 C58-C60 C62-C64 C74 C75 C80-C84 = CAP_0402: ConvertToPcb: yes; SymbolName: CapAcitance; ModelId: 36a51122f27c49738f86b3bfa98863e0; ModelName: C0402_L1.0-W0.5-H0.5; ModelTransform: 39.37,19.685,0,0,0,0,0,0,0; Device: CAP_0402; AddInBom: yes; Supplier Footprint: 0402; FootprintName: C0603
CE1 = 3.3uF/16V: 直插电解电容; Origin Footprint 1: C0805_M; Symbol: CE; 联系卖家，免费查找封装: 唯一出售店铺网址https://shop463601444.taobao.com; AddInBom: yes; Device: 3.3uF/16V; Design Item ID: CE; Library Name: 0.1 - 电阻-电容-电感-晶振-晶体-磁珠-电位器-法拉电容-馈通电容; BOM名称: 直插电解电容; Origin Footprint 2: C0805_M; ConvertToPcb: yes
CE2-CE5 = 22uF/16V: 直插电解电容; Origin Footprint 1: C0805_M; Symbol: CE; 联系卖家，免费查找封装: 唯一出售店铺网址https://shop463601444.taobao.com; AddInBom: yes; Device: 22uF/16V; Design Item ID: CE; Library Name: 0.1 - 电阻-电容-电感-晶振-晶体-磁珠-电位器-法拉电容-馈通电容; BOM名称: 直插电解电容; Origin Footprint 2: C0805_M; ConvertToPcb: yes
D1 D2 = SS24_C7420362: 二极管配置:独立式;正向压降(Vf):550mV@1.0A;直流反向耐压(Vr):40V;整流电流:2A;; Manufacturer: 宏迦橙; AddInBom: yes; ModelId: 7e24bebe6cd74171ae8c9de6fc5b78aa; ModelTransform: 198.4248,103.5431,0,180,0,0,0,0,0; Diode Configuration: 独立式; Reverse Voltage (Vr): 40V; Rectified Current: 2A; Reverse Leakage Current (Ir): 200uA@40V; Symbol: SS24_C7420362; Device: SS24_C7420362; LCSC Part Name: 电压:40V 电流:2A; SupplierPart: C7420362; Supplier Footprint: SMA(DO-214AC); JLCPCB Part Class: 扩展库; Datasheet: https://atta.szlcsc.com/upload/public/pdf/source/20230828/2D67628D7EFDC2DD386D167E8AEA232D.pdf; Supplier: LCSC; ConvertToPcb: yes; FootprintName: SMA_L4.3-W2.6-LS5.0-FD; ModelName: SMA_L4.3-W2.6-LS5.0-FD; Forward Voltage (Vf@If): 550mV@1.0A
D3 = FR107_C963379: 二极管配置:-;正向压降(Vf):1.3V@1A;直流反向耐压(Vr):1kV;整流电流:1A;反向恢复时间(trr):500ns;; Manufacturer: JSMSEMI(杰盛微); ManufacturerPart: FR107; AddInBom: yes; ModelId: 7884390a25fb4c08947731ebfba7e3f8; ModelTransform: 144.8816,62.992,0,0,0,0,0,0,0; Reverse Voltage (Vr): 1kV; Rectified Current: 1A; Reverse Leakage Current (Ir): 5uA@1kV; Reverse Recovery Time (trr): 500ns; Symbol: FR107_C963379; Device: FR107_C963379; LCSC Part Name: FR107; SupplierPart: C963379; Supplier Footprint: SOD-123; Datasheet: https://atta.szlcsc.com/upload/public/pdf/source/20230807/039A8781E74C9E6DBC2E128AB501E48D.pdf; Supplier: LCSC; ConvertToPcb: yes; FootprintName: SOD-123_L2.8-W1.8-LS3.7-RD; ModelName: SOD-123_L2.8-W1.8-LS3.7-RD; Diode Configuration: -; Forward Voltage (Vf@If): 1.3V@1A; Operating Temperature: -55℃~+150℃
D4 D5 = BAT54S,215: 二极管配置:1对串联式;正向压降(Vf):800mV@100mA;直流反向耐压(Vr):30V;平均整流电流(Io):200mA;; Manufacturer: Nexperia(安世); AddInBom: yes; ModelId: 89cb27a44ab2466697082bb9fd73a7d0; ModelName: SOT-23-3L_L2.9-W1.6-H1.1-LS2.8-P0.95; ModelTransform: 110.59301,114.173,0,180,0,0,0,-0.0005,0; Diode Configuration: 1对串联式; Reverse Voltage (Vr): 30V; Average Rectified Current (Io): 200mA; Reverse Leakage Current (Ir): 2uA@25V; Symbol: BAT54S,215; Device: BAT54S,215; Supplier: LCSC; Manufacturer Part: BAT54S,215; Supplier Part: C47546; JLCPCB Part Class: 扩展库; LCSC Part Name: 电压:30V 电流:200mA; Supplier Footprint: SOT-23; Datasheet: https://atta.szlcsc.com/upload/public/pdf/source/20180326/C130910_AAC331EF45C4B7D7866DD336DA3C5D86.pdf; ConvertToPcb: yes; FootprintName: SOT-23-3_L3.0-W1.7-P0.95-LS2.9-BR; Forward Voltage (Vf@If): 800mV@100mA
H1 = HDR-F_2.54_1x4P: Symbol: 2.54-1*4P母; ConvertToPcb: yes; ModelId: d187812051054f85879fcaa51a310d8e; ModelTransform: 419.6842,98.464,0,0,0,0,0,0,-118.11; Device: HDR-F_2.54_1x4P; AddInBom: yes; SupplierPart: C2718488; Supplier Footprint: 插件; FootprintName: HDR-TH_4P-P2.54-V-F; ModelName: HDR-TH_4P-P2.54-V-F
H2 = HDR-M_2.54_1x3P: Symbol: PZ254V-11-03P_C2937625; ConvertToPcb: yes; ModelId: bb473b6d38ff42a99216a4fcdbdcc4cb; ModelName: HDR-TH_3P-P2.54-M-LI-1X3P; ModelTransform: 299.9994,100,0,0,0,0,0,0,-118.11; Device: HDR-M_2.54_1x3P; AddInBom: yes; SupplierPart: C2937625; Supplier Footprint: 插件; FootprintName: HDR-TH_3P-P2.54-V-M
H3 = HDR-M_2.54_1x2P: Symbol: 210S-1*2P L=11.6MMGold-plated black; ConvertToPcb: yes; ModelId: 79b2e9f2d70a4d68a1b7098f27c6d4c5; ModelName: HDR-M-2.54_1x2; ModelTransform: 200,100,0,0,0,0,0,0,-118.11; Device: HDR-M_2.54_1x2P; AddInBom: yes; SupplierPart: C124375; Supplier Footprint: 插件; FootprintName: HDR-TH_2P-P2.54-V-M-1
H4 = HDR-M_2.54_1x5P: Symbol: MTP125-1105S1; ConvertToPcb: yes; ModelId: 47d466e4a34f4fc5bc626cf773a24dd5; ModelName: HDR-TH_5P-P2.54-M-LI-1X5P; ModelTransform: 499.999,100,0,0,0,0,0,0,-118.11; Device: HDR-M_2.54_1x5P; AddInBom: yes; SupplierPart: C358687; Supplier Footprint: 插件; FootprintName: HDR-TH_5P-P2.54-V-M
L1 L4 L5 L8 L10 = L_0603: Symbol: SDFL1608S100KTF; AddInBom: yes; ModelId: 2bc5ec593d464d6ba9807aec0b5673c2; ModelName: L0603_L1.6-W0.8-H0.5_BEAD; ModelTransform: 62.992,31.496,0,180,0,0,0.094,0.629,0; Device: L_0603; Supplier Footprint: L0603; ConvertToPcb: yes; FootprintName: L0603
L2 L6 L7 L9 L11 = BLM15AG102SN1D: 标称阻抗@测试频率:1kΩ@100MHz;误差:±25%;直流电阻(RDC):650mΩ;; Manufacturer: muRata(村田); AddInBom: yes; ModelId: d8d36575a3234d4790bfa765c88664a7; ModelName: L0402_L1.0-W0.5-H0.5_BEAD; ModelTransform: 39.37,19.685,0,0,0,0,0,0.0005,0; Tolerance: ±25%; DC Resistance: 650mΩ; Current Rating: 300mA; Circuits: 1; Device: BLM15AG102SN1D; Symbol: BLM15AG102SN1D; LCSC Part Name: 单路 0402磁珠 阻抗1kΩ@100MHz; SupplierPart: C76883; ManufacturerPart: BLM15AG102SN1D; Supplier Footprint: 0402; JLCPCB Part Class: 扩展库; Datasheet: https://atta.szlcsc.com/upload/public/pdf/source/20181120/C333978_3E581FB55966932B05020139ABDE8E01.pdf; Supplier: LCSC; ConvertToPcb: yes; FootprintName: L0603; Impedance @ Frequency: 1kΩ@100MHz
L3 = FXL0630-100-M: 电感值:10uH;精度:±20%;额定电流:4.5A;饱和电流(Isat):5.5A;类型:一体成型电感;; Manufacturer: cjiang(长江微电); AddInBom: yes; ModelId: e28854526ca747668ea12fbe1dd39a63; ModelName: IND-SMD_L7.3-W6.8-H3.0; ModelTransform: 292.125,267.716,0,0,0,0,0,0,0; Tolerance: ±20%; Rated Current: 4.5A; Saturation Current (Isat): 5.5A; DC Resistance (DCR): 68mΩ; Type: 一体成型电感; Symbol: FXL0630-100-M; Device: FXL0630-100-M; LCSC Part Name: 10uH ±20% 5.5A; SupplierPart: C167223; ManufacturerPart: FXL0630-100-M; Supplier Footprint: SMD,6.6x7mm; JLCPCB Part Class: 扩展库; Datasheet: https://atta.szlcsc.com/upload/public/pdf/source/20240426/3189EA8206330E2108542F9E34E540E7.pdf; Supplier: LCSC; ConvertToPcb: yes; FootprintName: IND-SMD_L7.3-W6.8; Ratings: -
LED1-LED6 = LED_0603-R: Symbol: LED_R; Convert to PCB: yes; 3D Model: dd8257b0d61a4cd7b68939a056e08095; 3D Model Transform: 58.72,29.4,22.03,0,0,0,0,0,0; ModelName: LED-0603_R; Device: LED_0603-R; Add into BOM: yes; Supplier Footprint: 0603; FootprintName: LED_0603
Q1 Q3 = AO3401A_P: Symbol: P_MOS; AddInBom: yes; ModelId: c62791f0466c4ae2a892c056b845b0ca; ModelName: SOT-23-3P_L2.9-W1.3-H1.0-LS2.4-P0.95; ModelTransform: 98.6,114.12,41.29,180,0,0,0,0,0; Device: AO3401A_P; Supplier Footprint: SOT-23-3L; ConvertToPcb: yes; FootprintName: AO3401A_SOT-23-3; SupplierPart: C15127
Q2 Q6 Q7 = S8050_SOT_NPN: ConvertToPcb: yes; SymbolName: NPN; ModelId: c62791f0466c4ae2a892c056b845b0ca; ModelName: SOT-23-3P_L2.9-W1.3-H1.0-LS2.4-P0.95; ModelTransform: 98.6,114.12,41.29,180,0,0,0,0,-3; Device: S8050_SOT_NPN; AddInBom: yes; Supplier Footprint: SOT-23; FootprintName: S8050_SOT-23
Q4 = AO3400A_N: 类型:N沟道;漏源电压(Vdss):30V;连续漏极电流(Id):5.2A;功率(Pd):1W;导通电阻(RDS(on)@Vgs,Id):35mΩ@10V,5A;阈值电压(Vgs(th)@Id):1.5V@250μA;; Symbol: N_MOS; AddInBom: yes; ModelId: c62791f0466c4ae2a892c056b845b0ca; ModelName: SOT-23-3P_L2.9-W1.3-H1.0-LS2.4-P0.95; ModelTransform: 98.425,114.173,0,180,0,0,0.0005,-0.0005,0; Device: AO3400A_N; Supplier Footprint: SOT-23; ConvertToPcb: yes; FootprintName: SOT-23-3_L2.9-W1.3-P1.90-LS2.4-BR; SupplierPart: C700953
Q5 = AO3400A_C20917: 类型:1个N沟道;漏源电压(Vdss):30V;连续漏极电流(Id):5.7A;导通电阻(RDS(on)@Vgs,Id):26.5mΩ@10V,5.7A;功率(Pd):1.4W;阈值电压(Vgs(th)@Id):1.5V@250uA;; Manufacturer: AOS; AddInBom: yes; ModelId: c62791f0466c4ae2a892c056b845b0ca; ModelName: SOT-23-3P_L2.9-W1.3-H1.0-LS2.4-P0.95; ModelTransform: 98.425,114.173,0,180,0,0,0.0005,-0.0005,0; Type: 1个N沟道; Drain Source Voltage (Vdss): 30V; Power Dissipation (Pd): 1.4W; Total Gate Charge (Qg@Vgs): 7nC@4.5V; Input Capacitance (Ciss@Vds): 630pF@15V; Symbol: AO3400A; Device: AO3400A_C20917; LCSC Part Name: 1个N沟道 耐压:30V 电流:5.7A; SupplierPart: C20917; ManufacturerPart: AO3400A; Supplier Footprint: SOT-23-3L; Datasheet: https://atta.szlcsc.com/upload/public/pdf/source/20140107/1457706668533.pdf; Supplier: LCSC; ConvertToPcb: yes; FootprintName: SOT-23-3_L2.9-W1.3-P1.90-LS2.4-BR; Continuous Drain Current (Id): 5.7A; Drain Source On Resistance (RDS(on)@Vgs,Id): 26.5mΩ@10V,5.7A; Gate Threshold Voltage (Vgs(th)@Id): 1.5V@250uA; Operating Temperature: -55℃~+150℃@(Tj)
R1-R11 R13 R16 R17 R19 R22 R24-R102 = Res_0603: Symbol: 电阻; ConvertToPcb: yes; ModelId: fc143cca1e79419f9cd78b61e9279f08; ModelTransform: 31.8897,63.7794,0,90,0,0,0,0,0; Device: Res_0603; AddInBom: yes; Supplier Footprint: 0603; FootprintName: R0603; ModelName: R0603
R12 R20 R21 = Res_0603: Convert to PCB: yes; Symbol: 电阻; ModelId: fc143cca1e79419f9cd78b61e9279f08; ModelTransform: 31.8897,63.7794,0,90,0,0,0,0,0; Add into BOM: yes; Device: Res_0603; Supplier Footprint: 0603; FootprintName: R0603; ModelName: R0603
R14 R15 R18 R23 = Res_0805: Symbol: 电阻; ConvertToPcb: yes; ModelId: 37a81e68749a4138bd2dfa6897b24b85; ModelName: R0805_L2.0-W1.3-H0.6; ModelTransform: 78.74,51.181,0,0,0,0,0,-0.0005,0; Device: Res_0805; AddInBom: yes; Supplier Footprint: 0805; FootprintName: R0603
SCREW1-SCREW4 = M3螺丝: ConvertToPcb: yes; SymbolName: 螺丝孔; Device: M3螺丝; AddInBom: yes; Supplier Footprint: 插件; FootprintName: M3螺丝
SW1 = Key_SMD_3.6x6.1x2.5: SymbolName: 轻触按键x2; AddInBom: yes; ModelId: 90d18ad19a7e424ebd3215e1b5dcb80c聨0819f05c4eef4c71ace90d822a990e87; ModelName: KEY-SMD_2P-L6.0-W3.6-H2.5-LS8.0 COPY; ModelTransform: 311.02,141.73,102.36,0,0,0,0,0,0; Device: Key_SMD_3.6x6.1x2.5; ConvertToPcb: yes; FootprintName: Key_SMD_3.6x6.1x2.5; Supplier Footprint: SMD
SW2-SW5 = Key_TH_6x6x6: 触点电流:50mA;额定电压(DC):12V;绝缘电阻:100MΩ;电路结构:单刀单掷;安装方式:直插;按钮形状:圆形按钮;按钮/盖帽颜色:黑色;作用力:260gf@±30gf;工作温度:-25℃~+70℃;引脚样式:PC引脚;开关长度:6mm;开关宽度:6mm;开关高度:6mm;带支架:否;; Symbol: 轻触按键; ConvertToPcb: yes; ModelId: 20eee248bc684ccd8cbdbb1d0d91ec6f; ModelName: SW-TH_4P-L6.0-W6.0-H5.0-LS6.5-P4.50; ModelTransform: 236.22,323.03,0,90,0,0,0,0,-137.795; Device: Key_TH_6x6x6; AddInBom: yes; SupplierPart: C2837516; Supplier Footprint: 插件; FootprintName: SW-TH_4P-L6.0-W6.0-P4.50-LS6.5
SW6 = XKB7070-Z: 自锁/无锁:自锁;安装方式:直插;触点电流:100mA;额定电压 (AC):250V;额定电压 (DC):30V;带灯:不带;作用力:160gf;机械寿命:10万次;; Manufacturer: XKB Connectivity(中国星坤); AddInBom: yes; ModelId: 65f5674ceb7247f197b01bc7adea0d8f; ModelTransform: 275.59,275.629,0,0,0,0,0,0,-137.795; Self Lock / No Lock: 自锁; Actuator Style: 矩形按钮; Contact Current: 100mA; Voltage Rating (AC): 250V; Voltage Rating (DC): 30V; Insulation Resistance: 100MΩ; Actuator/Cap Color: 蓝色; With Lamp: 不带; Pin Style: PC引脚; Operating Force: 160gf; Mechanical Life: 10万次; Symbol: XKB7070-Z; Device: XKB7070-Z; LCSC Part Name: 按键开关   7*7插件自锁 蓝白黑; SupplierPart: C318863; ManufacturerPart: XKB7070-Z; Supplier Footprint: 插件; JLCPCB Part Class: 扩展库; Datasheet: https://atta.szlcsc.com/upload/public/pdf/source/20211015/75A682A27A424BDE8D93C2CFA14C38FE.pdf; Supplier: LCSC; ConvertToPcb: yes; FootprintName: SW-TH_6P-L7.0-W7.0-P2.00; ModelName: SW-TH_6P-L7.0-W7.0-P2.00; IP Rating: -; Mounting Style: 直插; Operating Temperature: -15℃~+55℃
U1 U17 = RS8752XM: 放大器数:双路;增益带宽积(GBP):250MHz;输入偏置电流(Ib):1pA;输入失调电压(Vos):1.5mV;压摆率(SR):180V/us;带宽(-3db):250MHz;; Manufacturer: RUNIC(润石); Relevance: []; AddInBom: yes; ModelId: 1de5a054e9244f539c6db8238d445f94; ModelTransform: 118.11,196.85,0,0,0,0,0,0,0; Number of Circuits: 双路; Gain Bandwidth Product(GBP): 250MHz; Current - Input Bias(Ib): 1pA; Voltage - Input Offset(Vos): 1.5mV; Supply Current: 2.9mA; Symbol: RS8752XM; Device: RS8752XM; LCSC Part Name: 高速运放RS8752XM; SupplierPart: C255421; ManufacturerPart: RS8752XM; Supplier Footprint: MSOP-8; JLCPCB Part Class: 扩展库; Datasheet: https://atta.szlcsc.com/upload/public/pdf/source/20180801/C255422_28B98AAAFB3A51C5B40B4289640087D6.pdf; Supplier: LCSC; ConvertToPcb: yes; FootprintName: MSOP-8_L3.0-W3.0-P0.65-LS5.0-BL; ModelName: MSOP-8_L3.0-W3.0-P0.65-LS5.0-BL; Slew Rate(SR): 180V/us; -3db Bandwidth: 250MHz
U2 U14 U16 U19 U20 = 74HC4052M/TR: Manufacturer: HGSEMI(华冠); AddInBom: yes; ModelId: ed96d47c1e844792b3e705d722a1a1fa; ModelTransform: 389.763,236.22,0,0,0,0,0,0,0; Device: 74HC4052M/TR; LCSC Part Name: 高速 CMOS 差分 4 通道模拟多路复用器和多路信号分离器; SupplierPart: C507179; ManufacturerPart: 74HC4052M/TR; Supplier Footprint: SOP-16; JLCPCB Part Class: 扩展库; Datasheet: https://atta.szlcsc.com/upload/public/pdf/source/20200402/C507179_EDEF75F06BD662FE8D3145782CF64ACB.pdf; Supplier: LCSC; ConvertToPcb: yes; SymbolName: 74HC4052M/TR; FootprintName: SOP-16_L10.0-W3.9-P1.27-LS6.0-BL; ModelName: SOP-16_L9.9-W3.9-P1.27-LS6.0-BL
U3 = AD9833BRMZ-REEL7_C9652: 电源电压:2.3V~5.5V;分辨率(位):10;自宽调谐(最大值):28b;; Manufacturer: ADI(亚德诺); AddInBom: yes; ModelId: b42a31f9e1fa4643bc7ea573b9bba7ed; ModelName: MSOP-10_L3.0-W3.0-H1.1-LS5.0-P0.50; ModelTransform: 118.11,196.85,0,0,0,0,0,0,0; Resolution (Bits): 10; Tuning  Word Width(Max): 28b; The main FCLK: 25MHz; Symbol: AD9833BRMZ; Device: AD9833BRMZ-REEL7_C9652; LCSC Part Name: AD9833低功耗DDS设备; SupplierPart: C9652; ManufacturerPart: AD9833BRMZ-REEL7; Supplier Footprint: MSOP-10; JLCPCB Part Class: 扩展库; Datasheet: https://atta.szlcsc.com/upload/public/pdf/source/20121029/1457706544172.pdf; Supplier: LCSC; ConvertToPcb: yes; FootprintName: MSOP-10_L3.0-W3.0-P0.50-LS5.0-BL; Supply Voltage: 2.3V~5.5V; Operating Temperature: -40℃~+85℃
U4 = STC32G12K128-35I-LQFP48: Manufacturer: STC; AddInBom: yes; ModelId: 093be70396ff421eb2cdb946d5311efc; ModelName: LQFP-48_L7.0-W7.0-H1.4-LS9.0-P0.50; ModelTransform: 354.331,354.331,0,0,0,0,0,0,0; Symbol: STC32G12K128-35I-LQFP48; Device: STC32G12K128-35I-LQFP48; LCSC Part Name: STC32G12K128-35I-LQFP48; SupplierPart: C5210760; ManufacturerPart: STC32G12K128-35I-LQFP48; Supplier Footprint: LQFP-48(7x7); JLCPCB Part Class: 扩展库; Datasheet: https://atta.szlcsc.com/upload/public/pdf/source/20241226/E8981118341CB9C62D3D58EFD7554832.pdf; Supplier: LCSC; ConvertToPcb: yes; FootprintName: LQFP-48_L7.0-W7.0-P0.50-LS9.0-BL
U5 = CH340N: Manufacturer: WCH(南京沁恒); Symbol: CH340N_C2977777; AddInBom: yes; ModelId: 75c24a7891ee4dd6bdac16a7163ff87e; ModelName: SOP-8_L4.9-W3.9-P1.27-LS6.0-BL-1; ModelTransform: 192.913,236.22,0,0,0,0,0,0,0; Device: CH340N; LCSC Part Name: USB转串口芯片 CH340; SupplierPart: C2977777; ManufacturerPart: CH340N; Supplier Footprint: SOP-8; JLCPCB Part Class: 扩展库; Datasheet: https://atta.szlcsc.com/upload/public/pdf/source/20230530/6E401E9554E9F5311886CC8B3F89B62E.pdf; Supplier: LCSC; ConvertToPcb: yes; FootprintName: SOP-8_L4.9-W3.9-P1.27-LS6.0-BL
U6 = TP4056-42-ESOP8: 锂电池充电芯片 42代表电池满电电压4.2V。; Manufacturer: TOPPOWER(南京拓微); Symbol: TP4056; AddInBom: yes; ModelId: d3e00daa36c445139c055a3b9efb85d2; ModelName: ESOP-8_L4.9-W3.9-H1.6-LS6.0-P1.27; ModelTransform: 240.157,192.913,0,90,0,0,0,0,0; Device: TP4056-42-ESOP8; LCSC Part Name: TP4056-42-ESOP8; SupplierPart: C16581; ManufacturerPart: TP4056-42-ESOP8; Supplier Footprint: ESOP-8; JLCPCB Part Class: 扩展库; Datasheet: https://atta.szlcsc.com/upload/public/pdf/source/20190626/C16581_611BCF5D7CF554EAE465137A8F68DB3E.pdf; Supplier: LCSC; ConvertToPcb: yes; FootprintName: ESOP-8_L4.9-W3.9-P1.27-LS6.0-BL-EP
U7 = RT9193: Origin Footprint: SOT23-5; AddInBom: yes; Device: RT9193; Symbol: RT9193; Design Item ID: RT9193; Library Name: MXT; ConvertToPcb: yes
U8 = SGM3204: Origin Footprint: SOT23-6; AddInBom: yes; Device: SGM3204; Symbol: SGM3204; Design Item ID: SGM3204; Library Name: MXT; ConvertToPcb: yes
U9 = RS8554XQ: 放大器数:四路;增益带宽积(GBP):4.5MHz;压摆率(SR):2.7V/us;; Manufacturer: RUNIC(润石); Relevance: []; AddInBom: yes; ModelId: 02f1f60386074b2ca8e111040ac061f2; ModelName: TSSOP-14_L5.0-W4.4-H1.0-LS6.4-P0.65; ModelTransform: 237.007,196.85,0,90,0,0,0,0,0; Number of Circuits: 四路; Gain Bandwidth Product(GBP): 4.5MHz; Supply Voltage: 2.7V~5.5V; Symbol: RS8554XQ; Device: RS8554XQ; LCSC Part Name: 精密运放RS8554XQ; SupplierPart: C255429; ManufacturerPart: RS8554XQ; Supplier Footprint: TSSOP-14; JLCPCB Part Class: 扩展库; Datasheet: https://atta.szlcsc.com/upload/public/pdf/source/20180801/C255431_5DFA0183D1ACA7F14A60743D93152121.pdf; Supplier: LCSC; ConvertToPcb: yes; FootprintName: TSSOP-14_L5.0-W4.4-P0.65-LS6.4-BL; Slew Rate(SR): 2.7V/us; Operating Temperature: -40℃~+125℃
U10 = SX1308: 功能类型:升压型;输出类型:可调;工作电压:2V~24V;输出电压:28V;输出电流:2A;; Manufacturer: SX(硕芯科技); AddInBom: yes; ModelId: 18da8f6c14a34920b3e136b5c401a119; ModelName: SOT-23-6_L2.9-W1.6-H1.5-LS2.8-P0.95; ModelTransform: 110.236,113.364,0,90,0,0,0.0005,0.0005,0; Function: 升压型; Output Type: 可调; Voltage - Supply: 2V~24V; Output Voltage: 28V; Output Current: 2A; Frequency - Switching: 1.2MHz; Synchronous Rectifier: 否; Number of Outputs: 1; Topology: 升压式; Quiescent Current: 100uA; Switch tube (built-in/external): 内置; Symbol: SX1308; Device: SX1308; LCSC Part Name: 高效1.2MHz 2A升压转换器; SupplierPart: C78162; ManufacturerPart: SX1308; Supplier Footprint: SOT-23-6; JLCPCB Part Class: 扩展库; Datasheet: https://atta.szlcsc.com/upload/public/pdf/source/20160920/1474356679185.pdf; Supplier: LCSC; ConvertToPcb: yes; FootprintName: SOT-23-6_L2.9-W1.6-P0.95-LS2.8-BL; Operating Temperature: -40℃~+85℃
U11 U18 = RS8554XP: 放大器数:四路;增益带宽积(GBP):4.5MHz;输入偏置电流(Ib):1pA;压摆率(SR):2.7V/us;轨到轨:-;; Manufacturer: RUNIC(润石); AddInBom: yes; ModelId: 8dbf5b715d42428c85558507ae5a252b; ModelName: SOIC-14_L8.6-W3.9-H1.8-LS6.0-P1.27; ModelTransform: 338.583,236.22,0,0,0,0,0,-0.001,0; Number of Circuits: 四路; Gain Bandwidth Product(GBP): 4.5MHz; Current - Input Bias(Ib): 1pA; Supply Voltage: 2.7V~5.5V; Output Current: 50mA; Symbol: RS8554XP; Device: RS8554XP; LCSC Part Name: RS8554XP; SupplierPart: C236997; ManufacturerPart: RS8554XP; Supplier Footprint: SOIC-14; JLCPCB Part Class: 扩展库; Datasheet: https://atta.szlcsc.com/upload/public/pdf/source/20180704/C236997_BF74C37E35A725D699BA91BFBED4064A.pdf; Supplier: LCSC; ConvertToPcb: yes; FootprintName: TSSOP-14_L5.0-W4.4-P0.65-LS6.4-BL; Slew Rate(SR): 2.7V/us; Output Type: -; Rail to Rail: -; Operating Temperature: -40℃~+125℃
U12 = CD4053BDTR(XBLW): 导通电阻(Ron@VCC):350Ω;; Manufacturer: XBLW(芯伯乐); AddInBom: yes; ModelId: ed96d47c1e844792b3e705d722a1a1fa; ModelTransform: 389.763,236.22,0,0,0,0,0,0,0; Supply Voltage: 3V~9V; On-State Resistance (Max): 350Ω; Symbol: CD4053BDTR(XBLW); Device: CD4053BDTR(XBLW); LCSC Part Name: CD4053BDTR(XBLW); SupplierPart: C19708120; ManufacturerPart: CD4053BDTR(XBLW); Supplier Footprint: SOP-16; JLCPCB Part Class: 扩展库; Datasheet: https://atta.szlcsc.com/upload/public/pdf/source/20231215/0C9D8E7420B1DBE63C1B545CF8B3B4AB.pdf; Supplier: LCSC; ConvertToPcb: yes; FootprintName: SOP-16_L9.9-W3.9-P1.27-LS6.0-BL; ModelName: SOP-16_L9.9-W3.9-P1.27-LS6.0-BL; Operating Temperature: -40℃~+85℃
U13 = GAQY211G2S: 触点形式:-;适用负载类型:-;正向压降(Vf):1.2V;负载电压:40V;连续负载电流:2.5A;导通电阻:60mΩ;; Manufacturer: SUPSiC(国晶微半导体); AddInBom: yes; ModelId: 7a816c7b730e4b8989440f8e2ea085d3; ModelName: SOP-4_L4.0-W4.4-H2.1-LS7.0-P2.54; ModelTransform: 157.48,275.591,0,90,0,0,0,0,0; Input Forward Voltage: 1.2V; Voltage - Load: 40V; Continuous Load Current: 2.5A; On Resistance: 60mΩ; Isolation Voltage(rms): 2.5kV; Turn-on time: 800us; Turn-off time: 20us; Symbol: GAQY211G2S; Device: GAQY211G2S; LCSC Part Name: GAQY211G2S 1 Form A(SPST-NO) 负载电压:40V 连续负载电流:2.5A; SupplierPart: C7435104; ManufacturerPart: GAQY211G2S; Supplier Footprint: SOP-4; JLCPCB Part Class: 扩展库; Datasheet: https://atta.szlcsc.com/upload/public/pdf/source/20241011/4BAA9F2B28F4E3269CE00069A12AE23B.pdf; Supplier: LCSC; ConvertToPcb: yes; FootprintName: SOP-4_L4.4-W4.0-P2.54-LS7.0-TL; Relay Contact Form: -; Load Type: -
U15 = hfd31/5: AddInBom: yes; Device: hfd31/5; ConvertToPcb: yes; SymbolName: hfd31/5; FootprintName: hfd31/5
USBC1 = TYPE-C-31-M-12: 连接器类型:Type-C;标准:-;公母:母;安装方式:-;触点数量:16P;端口数量:1;额定电流 - 电源:5A;工作温度范围:-;; Manufacturer: 韩国韩荣; AddInBom: yes; ModelId: 35058e297fd54ee2afd2de30c3ce7155; ModelTransform: 351.9678,311.023,0,180,0,0,0,-45.041,-39.37; Connector Type: Type-C; Gender: 母; Number of Contacts: 16P; Number of Ports: 1; Current Rating - Power (Max): 5A; Symbol: TYPE-C-31-M-12; Device: TYPE-C-31-M-12; LCSC Part Name: Type-C 母; SupplierPart: C165948; ManufacturerPart: TYPE-C-31-M-12; Supplier Footprint: SMD; JLCPCB Part Class: 扩展库; Datasheet: https://atta.szlcsc.com/upload/public/pdf/source/20220525/466408E853115E789EDB0DDC29077C05.pdf; Supplier: LCSC; ConvertToPcb: yes; FootprintName: USB-C_SMD-TYPE-C-31-M-12; ModelName: USB-C_SMD-TYPE-C-31-M-12; Standard: -; Mounting Style: -; Operating Temperature Range: -
X1 = OT322525MJBA4SL: 频率:25MHz;常温频差:±10ppm;输出模式:CMOS;工作电压:1.8V~3.3V;工作电流:5mA;频率稳定度:±20ppm;; Manufacturer: YXC(扬兴晶振); AddInBom: yes; ModelId: ae22b8d143894765bc8100c37cb6356f; ModelName: OSC-SMD_4P-L3.2-W2.5-H1.0; ModelTransform: 125.984,98.425,0,0,0,0,0,0,0; Normal temperature Frequency Tolerance: ±10ppm; Output Type: CMOS; Current - Supply: 5mA; Frequency Stability: ±20ppm; Symbol: OT322525MJBA4SL; Device: OT322525MJBA4SL; LCSC Part Name: 25MHz ±10ppm 1.8V~3.3V YSO110TR; SupplierPart: C669088; ManufacturerPart: OT322525MJBA4SL; Supplier Footprint: SMD3225-4P; JLCPCB Part Class: 扩展库; Datasheet: https://atta.szlcsc.com/upload/public/pdf/source/20240731/596E5F7673E50DA744B7F79F139FB8DF.pdf; Supplier: LCSC; ConvertToPcb: yes; FootprintName: OSC-SMD_4P-L3.2-W2.5-BL; Voltage - Supply: 1.8V~3.3V; Operating Temperature: -40℃~+85℃
X2 = X49SM8MSD2SC: 晶振类型:贴片晶振;频率:8MHz;常温频差:±20ppm;外接负载电容:20pF;频率稳定度(全温):±30ppm;; Manufacturer: YXC(扬兴晶振); AddInBom: yes; ModelId: 6f569b91267b44029b8615eb5c810fba; ModelName: HC-49S_L11.4-W1.8-H3.0-LS12.7; ModelTransform: 499.999,188.976,0,180,0,0,0.002,-0.002,0; Crystal Type: 贴片晶振; Normal temperature Frequency Tolerance: ±20ppm; External load capacitor: 20pF; Frequency Stability(Full temperature range): ±30ppm; Symbol: X49SM8MSD2SC; Device: X49SM8MSD2SC; LCSC Part Name: 8MHz ±20ppm 20pF; ManufacturerPart: X49SM8MSD2SC; Supplier Footprint: HC-49S-SMD; JLCPCB Part Class: 基础库; Datasheet: https://atta.szlcsc.com/upload/public/pdf/source/20240329/3EBF42EBCAB50CA65B6FA9D7CFA1955A.pdf; Supplier: LCSC; ConvertToPcb: yes; FootprintName: CRYSTAL-SMD_L11.5-W4.8-LS12.7; Operating Temperature: -20℃~+70℃